# EAGLE design aufsatz_v2.1_lm75 (EAGLE 6.5.0)
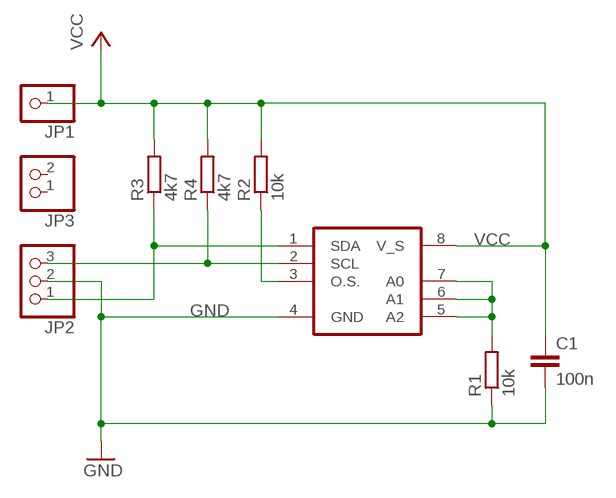
[diagram p0: schematic, sheet 1]

## Parts
C1  100n  C-EUC0805  [C0805]
JP1  PINHD-1X1  [1X01]
JP2  PINHD-1X3  [1X03]
JP3  PINHD-1X2  [1X02]
R1  10k  R-EU_R0805  [R0805]
R2  10k  R-EU_0204/5  [0204/5]
R3  4k7  R-EU_0204/7  [0204/7]
R4  4k7  R-EU_R0805  [R0805]
U$1  LM75  [SOIC8]

## Nets
GND: C1.2 JP2.2 R1.1 U$1.4(GND)
N$1: R1.2 U$1.5(A2) U$1.6(A1) U$1.7(A0)
N$3: R2.1 U$1.3(O.S.)
SCL: JP2.3 R4.1 U$1.2(SCL)
SDA: JP2.1 R3.1 U$1.1(SDA)
VCC: C1.1 JP1.1 R2.2 R3.2 R4.2 U$1.8(V_S)
Unconnected: JP3.1 JP3.2

## Library data of the parts
C1 = rcl:C-EU: CAPACITOR, European symbol
JP1 = pinhead:PINHD-1X1: PIN HEADER
JP2 = pinhead:PINHD-1X3: PIN HEADER
JP3 = pinhead:PINHD-1X2: PIN HEADER
R1-R4 = rcl:R-EU_: RESISTOR, European symbol
U$1 = n39:LM75: I²C Digitaler Temperatursensor, SO-8 Reichelt: LM 75 SMD <https://secure.reichelt.de/index.html?ARTICLE=49349>; REICHELT: LM 75 SMD

## Board
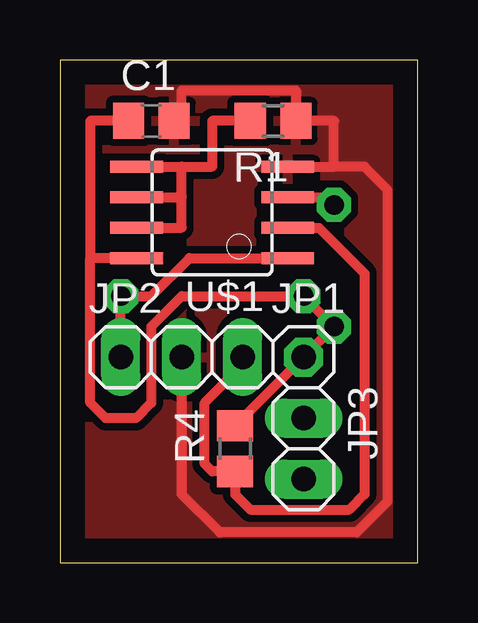
[diagram p1: board, top side]
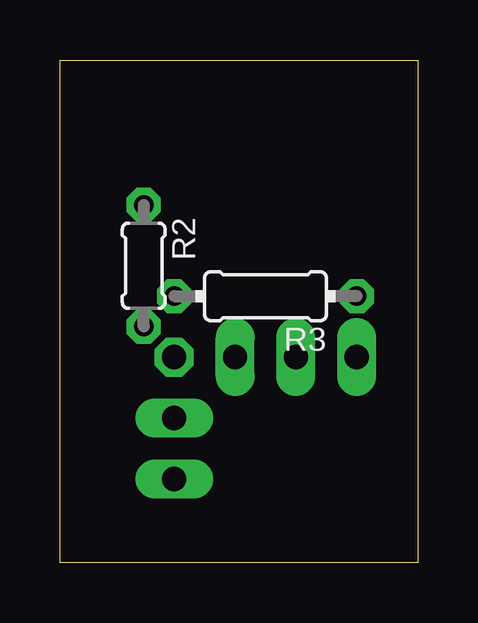
[diagram p2: board, bottom side, seen from below]

Size 14.92 x 20.95 mm. Coordinates in mm from the lower left corner, seen from the top.
Outline: 0,0 14.92,0 14.92,20.95 0,20.95 0,0
Copper layers (1*16): Top 0.035mm / dielectric 1.5mm / Bottom 0.035mm
Design rules "default *": minimum track width 12mil, minimum drill 24mil, track to track 12mil, track to pad 12mil, pad to pad 12mil, via to via 12mil, smd to smd 8mil, copper to edge 40mil, drill to drill 8mil, minimum pad ring 12mil, minimum via ring 12mil, stop-mask expansion 4mil, vias tented up to drill 0mil, thermal gap 10mil

### Footprints (pad centres in the part's own frame; a part is rotated, then mirrored left to right if it is on the bottom)
C0805 = smd 1.3 x 1.5: 1 -0.95,0; 2 0.95,0
1X01 = drill 1.016 octagon: 1 0,0
1X03 = drill 1.016 long: 1 -2.54,0; 2 0,0; 3 2.54,0
1X02 = drill 1.016 long: 1 -1.27,0; 2 1.27,0
R0805 = smd 1.3 x 1.5: 1 -0.95,0; 2 0.95,0
0204/5 = drill 0.813 octagon: 1 -2.54,0; 2 2.54,0
0204/7 = drill 0.813 octagon: 1 -3.81,0; 2 3.81,0
SOIC8 = smd 0.5 x 2.2: 1 -1.905,-3.154; 2 -0.645,-3.154; 3 0.625,-3.154; 4 1.895,-3.154; 5 1.905,3.154; 6 0.635,3.154; 7 -0.635,3.154; 8 -1.905,3.154

### Placement (x,y rotation side)
C1  3.81,18.41 0 top
JP1  10.16,8.57 0 top
JP2  5.08,8.57 0 top
JP3  10.16,4.76 270 top
R1  8.89,18.41 180 top
R2  11.43,12.38 270 bottom
R3  6.35,11.11 180 bottom
R4  7.3,4.76 90 top
U$1  6.35,14.61 90 top

### Tracks (layer width: path | path; a pad name or v marks a point on that pad's centre or on a via)
GND
  Top 0.406: C1.2 5.08,18.41 5.08,19.68 9.84,19.68 R1.1 11.43,18.41 11.43,16.51 | U$1.4 11.42,16.5 11.43,16.51 | 11.43,16.51 12.7,16.51 13.65,15.56 13.65,2.54 12.38,1.27 6.67,1.27 5.08,2.86 JP2.2
  pour Top: 0,20.95 14.92,20.95 14.92,0 0,0
N$1
  Top 0.406: R1.2 6.35,18.41 6.35,16.51 5.08,16.51 | U$1.5 5.08,16.51 | U$1.7 5.08,13.97 5.08,15.24 | U$1.6 5.08,15.24 | 5.08,15.24 5.08,16.51
N$3
  Top 0.406: U$1.3 11.12,15.23 R2.1
SCL
  Top 0.406: U$1.2 10.8,13.96 12.7,12.06 12.7,2.86 12.06,2.22 7.94,2.22 7.3,2.86 R4.1 6.35,3.81 6.03,4.13 6.03,6.67 7.62,8.26 JP2.3
SDA
  Top 0.406: JP2.1 R3.1 3.81,11.11 5.4,12.7 U$1.1
VCC
  Top 0.406: U$1.8 1.27,12.7 | C1.1 1.27,18.41 1.27,12.7 | 1.27,12.7 1.27,6.67 1.91,6.03 3.17,6.03 3.81,6.67 3.81,9.84 5.08,11.11 R3.2 R2.2 JP1.1 R4.2